# EAGLE design Beacon (EAGLE 9.4.2)
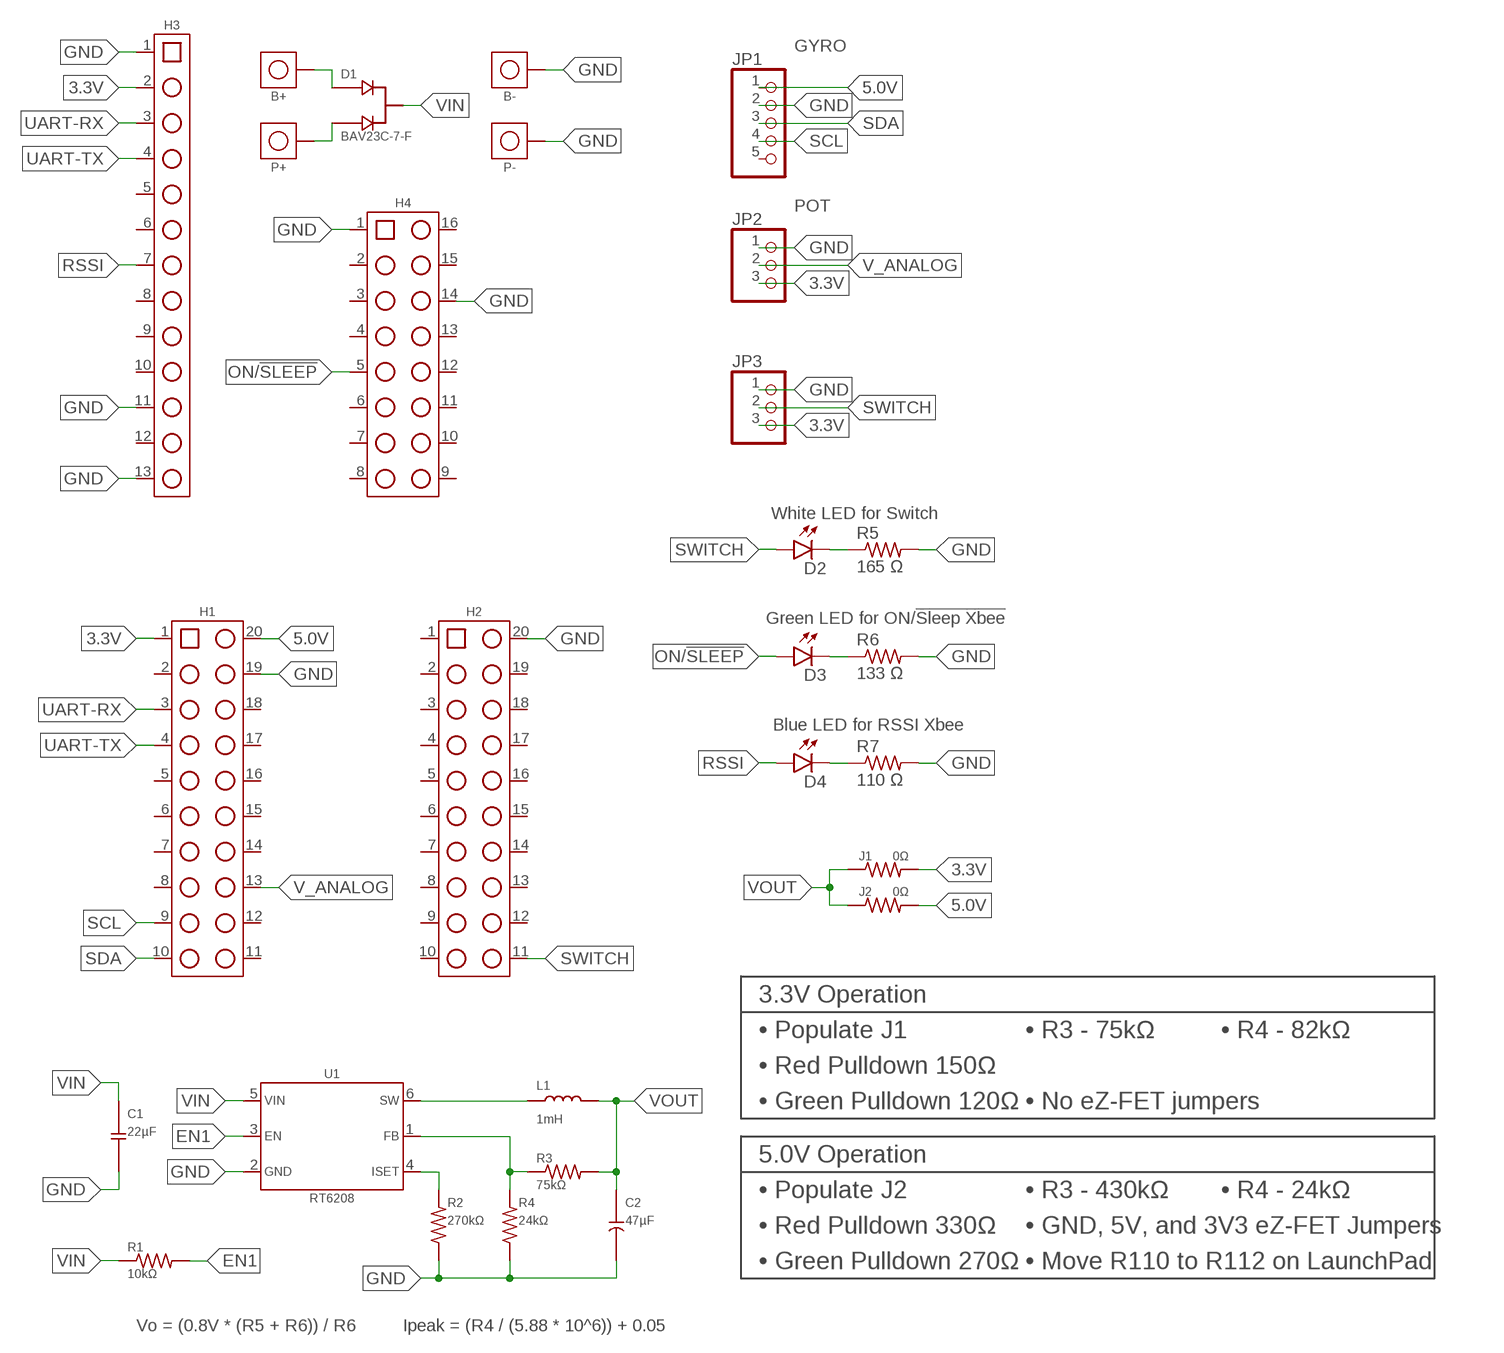
[diagram p0: schematic, sheet 1]

## Parts
B+  CON_HEADER-01WTB-24G  [THT_WTB-24G]
B-  CON_HEADER-01WTB-24G  [THT_WTB-24G]
C1  22µF  PAS_C1206  [SMT_1206]
C2  47µF  PAS_C-POLAR  [SMT_CAP-1206]
D1  BAV23C-7-F  SEM_DIODE-PAIR-CC  [SMT_SOT23-3]
D2  BEAGLEBONE_BLUE_LED-FKIT-1206  [BEAGLEBONE_BLUE_BEAGLEBONE_BLUE_FKIT-LED-1206]
D3  BEAGLEBONE_BLUE_LED-FKIT-1206  [BEAGLEBONE_BLUE_BEAGLEBONE_BLUE_FKIT-LED-1206]
D4  BEAGLEBONE_BLUE_LED-FKIT-1206  [BEAGLEBONE_BLUE_BEAGLEBONE_BLUE_FKIT-LED-1206]
H1  CON_HEADER-20  [CON_HEADER-0.1"-TH-2×10]
H2  CON_HEADER-20  [CON_HEADER-0.1"-TH-2×10]
H3  CON_HEADER-13SM-B  [CON_HEADER-2MM-SM-1×13B]
H4  CON_HEADER-16SM-B  [CON_HEADER-2MM-SM-1×16B]
J1  0Ω  PAS_R0603  [SMT_0603]
J2  0Ω  PAS_R0603  [SMT_0603]
JP1  PINHD-1X5  [1X05]
JP2  PINHD-1X3/90  [1X03/90]
JP3  PINHD-1X3/90  [1X03/90]
L1  1mH  PAS_L1210  [SMT_1210]
P+  CON_HEADER-01WTB-24G  [THT_WTB-24G]
P-  CON_HEADER-01WTB-24G  [THT_WTB-24G]
R1  10kΩ  PAS_R0603  [SMT_0603]
R2  270kΩ  PAS_R0603  [SMT_0603]
R3  75kΩ  PAS_R0603  [SMT_0603]
R4  24kΩ  PAS_R0603  [SMT_0603]
R5  165 Ω  ERJ-8GEY0R00V  [RES_1206]
R6  133 Ω  ERJ-8GEY0R00V  [RES_1206]
R7  110 Ω  ERJ-8GEY0R00V  [RES_1206]
U1  RT6208  [SMT_SOT23-6]

## Nets
3.3V: H1.1(PIN_1) H3.2(PIN_2) J1.2 JP2.3 JP3.3
5.0V: H1.20(PIN_20) J2.2 JP1.1
EN1: R1.2 U1.3(B)
FB: R3.1 R4.2 U1.1(E)
GND: B-.1(PIN_1) C1.1 C2.2 H1.19(PIN_19) H2.20(PIN_20) H3.1(PIN_1) H3.11(PIN_11) H3.13(PIN_13) H4.1(PIN_1) H4.14(PIN_14) JP1.2 JP2.1 JP3.1 P-.1(PIN_1) R2.1 R4.1 R5.2 R6.2 R7.2 U1.2(C)
ISET: R2.2 U1.4(D)
N$1: D2.C R5.1
N$2: D3.C R6.1
N$3: D4.C R7.1
N$55: B+.1(PIN_1) D1.1(A1)
N$56: D1.2(A2) P+.1(PIN_1)
ON/!SLEEP: D3.A H4.5(PIN_5)
RSSI: D4.A H3.7(PIN_7)
SCL: H1.9(PIN_9) JP1.4
SDA: H1.10(PIN_10) JP1.3
SW: L1.1 U1.6(F)
SWITCH: D2.A H2.11(PIN_11) JP3.2
UART-RX: H1.3(PIN_3) H3.3(PIN_3)
UART-TX: H1.4(PIN_4) H3.4(PIN_4)
V_ANALOG: H1.13(PIN_13) JP2.2
VIN: C1.2 D1.3(CC) R1.1 U1.5(A)
VOUT: C2.1 J1.1 J2.1 L1.2 R3.2
Unconnected: H1.2(PIN_2) H1.5(PIN_5) H1.6(PIN_6) H1.7(PIN_7) H1.8(PIN_8) H1.11(PIN_11) H1.12(PIN_12) H1.14(PIN_14) H1.15(PIN_15) H1.16(PIN_16) H1.17(PIN_17) H1.18(PIN_18) H2.1(PIN_1) H2.2(PIN_2) H2.3(PIN_3) H2.4(PIN_4) H2.5(PIN_5) H2.6(PIN_6) H2.7(PIN_7) H2.8(PIN_8) H2.9(PIN_9) H2.10(PIN_10) H2.12(PIN_12) H2.13(PIN_13) H2.14(PIN_14) H2.15(PIN_15) H2.16(PIN_16) H2.17(PIN_17) H2.18(PIN_18) H2.19(PIN_19) H3.5(PIN_5) H3.6(PIN_6) H3.8(PIN_8) H3.9(PIN_9) H3.10(PIN_10) H3.12(PIN_12) H4.2(PIN_2) H4.3(PIN_3) H4.4(PIN_4) H4.6(PIN_6) H4.7(PIN_7) H4.8(PIN_8) H4.9(PIN_9) H4.10(PIN_10) H4.11(PIN_11) H4.12(PIN_12) H4.13(PIN_13) H4.15(PIN_15) H4.16(PIN_16) JP1.5

## Notes on the sheet
- GYRO
- POT
- White LED for Switch
- Green LED for ON/!Sleep Xbee
- Blue LED for RSSI Xbee
- 3.3V Operation
- • Populate J1 | • R3 - 75kΩ | • R4 - 82kΩ
- • Red Pulldown 150Ω
- • Green Pulldown 120Ω | • No eZ-FET jumpers
- 5.0V Operation
- • Populate J2 | • R3 - 430kΩ | • R4 - 24kΩ
- • Red Pulldown 330Ω | • GND, 5V, and 3V3 eZ-FET Jumpers
- • Green Pulldown 270Ω | • Move R110 to R112 on LaunchPad
- Vo = (0.8V * (R5 + R6)) / R6 | Ipeak = (R4 / (5.88 * 10^6)) + 0.05

## Library data of the parts
B+ B- P+ P- = Andrew:CON_HEADER-01
C1 = Andrew:PAS_C
C2 = Andrew:PAS_C-POLAR
D1 = Andrew:SEM_DIODE-PAIR-CC: MMBD1204
D2-D4 = BeagleBone_Blue_R3:BEAGLEBONE_BLUE_LED: LEDs Standard schematic elements and footprints for 5mm, 3mm, 1206, and 0603 sized LEDs. 5mm - Spark Fun Electronics SKU : COM-00529 (and others)
H1 H2 = Andrew:CON_HEADER-20
H3 = Andrew:CON_HEADER-13; P1: 1
H4 = Andrew:CON_HEADER-16; P1: 22
J1 J2 R1-R4 = Andrew:PAS_R
JP1 = pinhead:PINHD-1X5: PIN HEADER
JP2 JP3 = pinhead:PINHD-1X3: PIN HEADER
L1 = Andrew:PAS_L
R5-R7 = Resistor_Capacitor:ERJ-8GEY0R00V: RES SMD 0 OHM JUMPER 1/4W 1206 Manufacturer's datasheet <https://industrial.panasonic.com/ww/products/resistors/chip-resistors/general-purpose-chip-resistors/thick-film-chip-resistors/ERJ8GEY0R00V>; CREATED_BY: PCBLayout.com; DIGIKEY_PART_NUMBER: P0.0ETR-ND; MANUFACTURER: Panasonic Electronic Components; MPN: ERJ-8GEY0R00V; PACKAGE: SMD 1206
U1 = Andrew:RT6208; A: VIN; B: EN; C: GND; D: ISET; E: FB; F: SW; P1: ▼

## Board
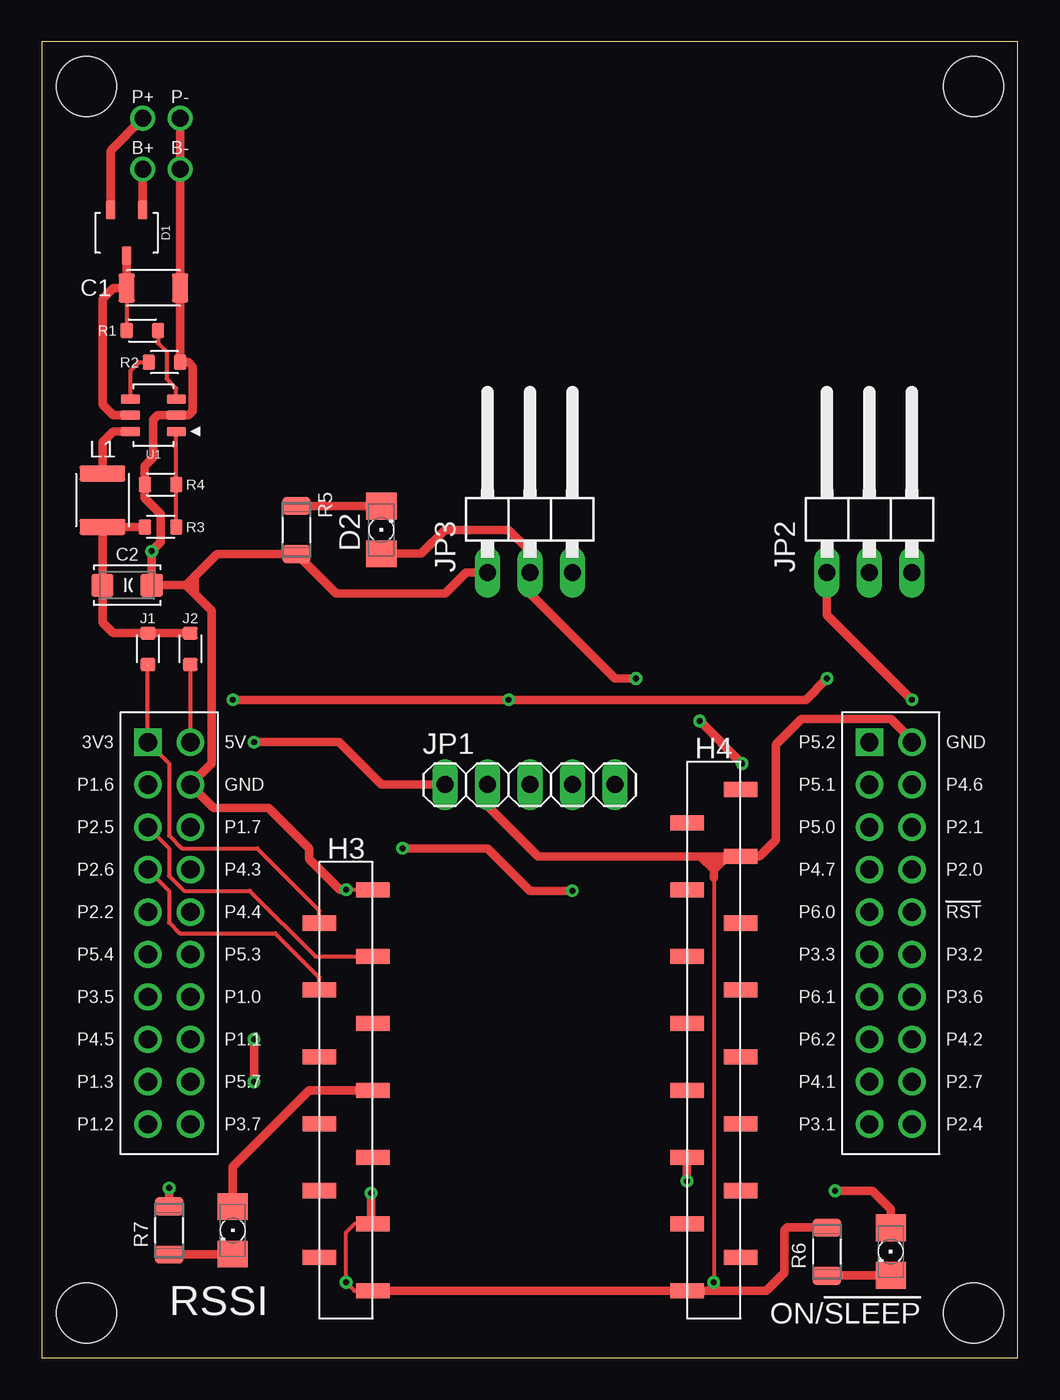
[diagram p1: board, top side]
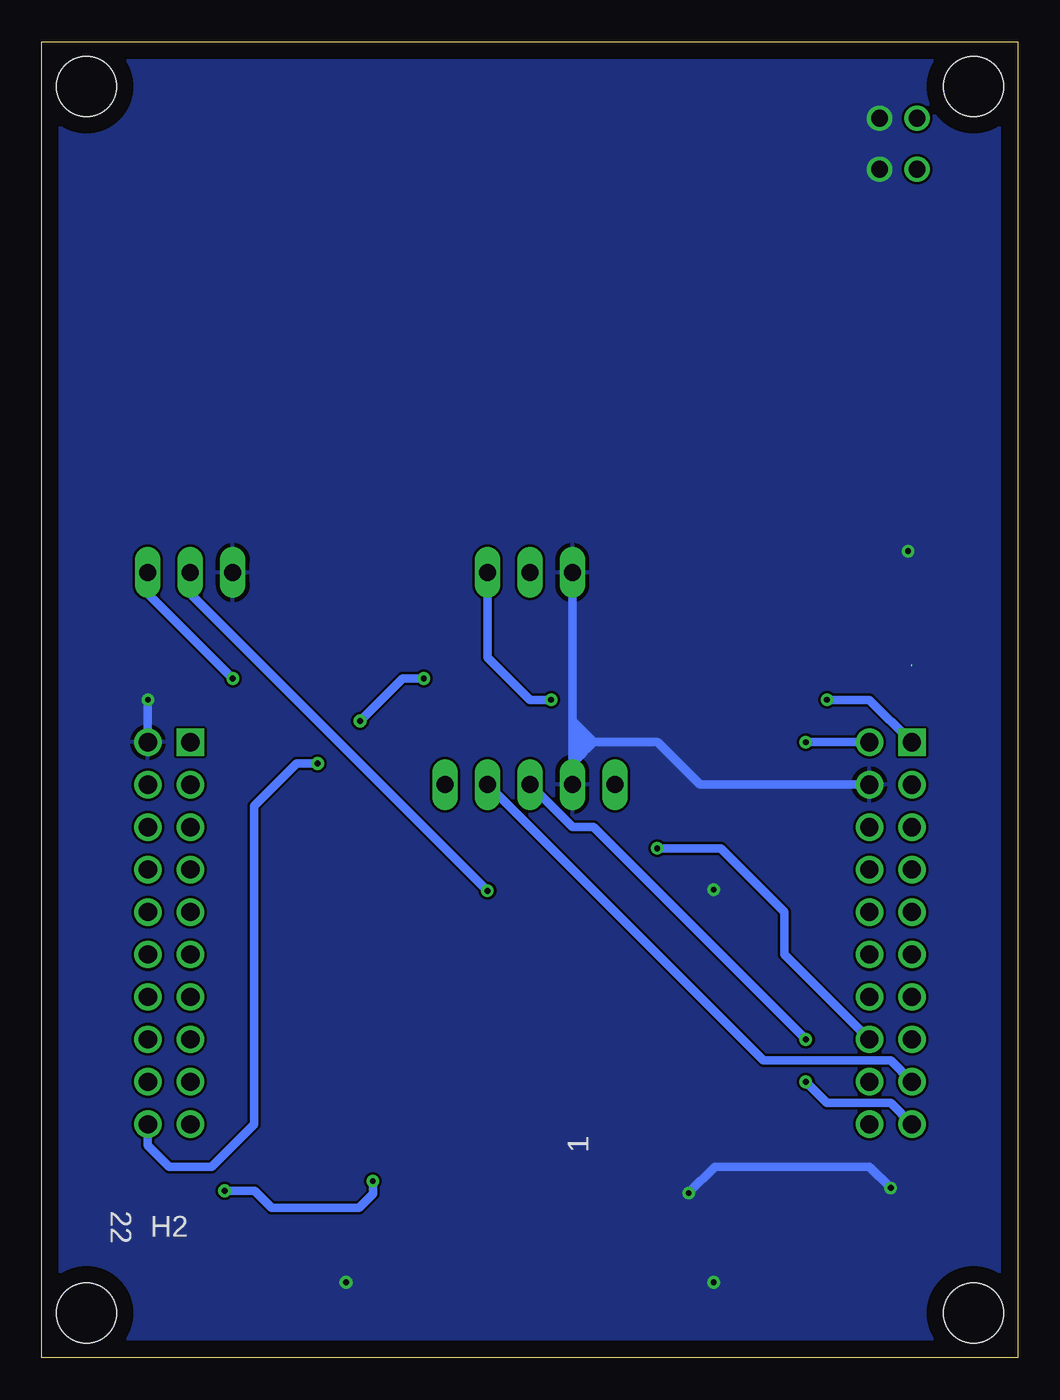
[diagram p2: board, bottom side, seen from below]

Size 58.42 x 78.74 mm. Coordinates in mm from the lower left corner, seen from the top.
Outline: 0,0 58.42,0 58.42,78.74 0,78.74 0,0
Copper layers (1*16): Top 0.035mm / dielectric 1.5mm / Bottom 0.035mm
Design rules "default": minimum track width 6mil, minimum drill 0.35mm, track to track 6mil, track to pad 6mil, pad to pad 6mil, via to via 6mil, smd to smd 6mil, copper to edge 40mil, drill to drill 6mil, minimum pad ring 10mil, minimum via ring 8mil, stop-mask expansion 4mil, vias tented up to drill 0mil, thermal gap 10mil
Holes 3.57 mm at 55.75,76.07 2.67,76.07 2.67,2.67 55.75,2.67

### Footprints (pad centres in the part's own frame; a part is rotated, then mirrored left to right if it is on the bottom)
THT_WTB-24G = drill 1: 1 0,0
SMT_1206 = smd 0.965 x 1.727: 1 -1.6,0; 2 1.6,0
SMT_CAP-1206 = smd 1.321 x 1.372: 1 -1.473,0; 2 1.473,0
SMT_SOT23-3 = smd 0.559 x 1.118: 1 -0.965,-1.372; 2 0.965,-1.372; 3 0,1.372
BEAGLEBONE_BLUE_BEAGLEBONE_BLUE_FKIT-LED-1206 = smd 1.6 x 1.803: A -1.422,0; C 1.422,0
CON_HEADER-0.1"-TH-2×10 = drill 1.092 square: 1 -11.43,-1.27 | drill 1.092: 2 -8.89,-1.27; 3 -6.35,-1.27; 4 -3.81,-1.27; 5 -1.27,-1.27; 6 1.27,-1.27; 7 3.81,-1.27; 8 6.35,-1.27; 9 8.89,-1.27; 10 11.43,-1.27; 11 11.43,1.27; 12 8.89,1.27; 13 6.35,1.27; 14 3.81,1.27; 15 1.27,1.27; 16 -1.27,1.27; 17 -3.81,1.27; 18 -6.35,1.27; 19 -8.89,1.27; 20 -11.43,1.27
CON_HEADER-2MM-SM-1×13B = smd 0.9 x 2: 1 -12,1.6; 2 -10,-1.6; 3 -8,1.6; 4 -6,-1.6; 5 -4,1.6; 6 -2,-1.6; 7 0,1.6; 8 2,-1.6; 9 4,1.6; 10 6,-1.6; 11 8,1.6; 12 10,-1.6; 13 12,1.6
CON_HEADER-2MM-SM-1×16B = smd 0.9 x 2: 1 -15,1.6; 2 -13,-1.6; 3 -11,1.6; 4 -9,-1.6; 5 -7,1.6; 6 -5,-1.6; 7 -3,1.6; 8 -1,-1.6; 9 1,1.6; 10 3,-1.6; 11 5,1.6; 12 7,-1.6; 13 9,1.6; 14 11,-1.6; 15 13,1.6; 16 15,-1.6
SMT_0603 = smd 0.762 x 0.914: 1 -0.94,0; 2 0.94,0
1X05 = drill 1.016 long: 1 -5.08,0; 2 -2.54,0; 3 0,0; 4 2.54,0; 5 5.08,0
1X03/90 = drill 1.016 long: 1 -2.54,-3.81; 2 0,-3.81; 3 2.54,-3.81
SMT_1210 = smd 0.965 x 2.743: 1 -1.6,0; 2 1.6,0
RES_1206 = smd 1.08 x 1.68: 1 -1.445,0; 2 1.445,0
SMT_SOT23-6 = smd 0.559 x 1.118: 1 -0.965,-1.372; 2 0,-1.372; 3 0.965,-1.372; 4 0.965,1.372; 5 0,1.372; 6 -0.965,1.372

### Placement (x,y rotation side)
B+  6.05,71.12 90 top
B-  8.28,71.12 90 top
C1  6.68,64.01 180 top
C2  5.11,46.23 0 top
D1  5.08,67.31 180 top
D2  20.32,49.53 90 top
D3  50.8,6.35 270 top
D4  11.43,7.62 270 top
H1  7.62,25.4 270 top
H2  50.8,25.4 270 top
H3  18.21,16 270 top
H4  40.21,19 90 top
J1  6.35,42.42 270 top
J2  8.89,42.42 270 top
JP1  29.21,34.29 0 top
JP2  49.53,50.8 0 top
JP3  29.21,50.8 0 top
L1  3.63,51.31 270 top
P+  6.05,74.17 90 top
P-  8.28,74.17 90 top
R1  6.02,61.47 0 top
R2  7.34,59.56 180 top
R3  7.11,49.71 180 top
R4  7.11,52.25 0 top
R5  15.24,49.53 270 top
R6  46.99,6.35 90 top
R7  7.62,7.62 90 top
U1  6.68,56.39 90 top

### Tracks (layer width: path | path; a pad name or v marks a point on that pad's centre or on a via)
3.3V  (via drill 0.35)  (1 unrouted)
  Top 0.254: H3.2 16.61,26.76 12.89,30.48 8.38,30.48 7.62,31.24 7.62,35.56 H1.1 6.35,41.4
  Top 0.508: v46.99,40.64 45.72,39.37 v27.94,39.37 v11.43,39.37
  Bottom 0.508: JP2.3 52.07,45.72 v46.99,40.64 | v11.43,39.37 8.89,39.37 H1.1 | v27.94,39.37 29.21,39.37 31.75,41.91 JP3.3
5.0V  (via drill 0.35)
  Top 0.254: J2.2 H1.20
  Top 0.508: v12.7,36.83 17.78,36.83 20.32,34.29 JP1.1
  Bottom 0.508: v12.7,36.83 H1.20
EN1
  Top 0.254: U1.3 8.05,57.99 7.47,58.57 7.47,60.2 6.96,60.71 R1.2
FB
  Top 0.254: R3.1 R4.2 U1.1
GND  (via drill 0.35)
  Top 0.254: H3.1 v18.21,28 | H4.1 39.37,4 39.7,4 v40.21,4.51 | 40.21,28.7 v40.21,4.51 | H3.13 18.72,4 v18.21,4.51 18.21,7.49 18.72,8 19.63,8 H3.11 | 40.64,4 40.64,4.08 v40.21,4.51 | v40.21,4.51 40.21,4
  Top 0.508: P-.1 B-.1 C1.1 R2.1 8.79,59.56 9.04,59.31 9.04,56.64 8.79,56.39 U1.2 6.93,56.39 6.68,56.13 6.68,53.85 6.17,53.34 R4.1 6.17,51.44 7.11,50.49 7.11,48.79 v6.58,48.26 C2.2 8.64,46.23 | 9.14,45.72 10.16,44.7 10.16,35.56 H1.19 10.29,32.89 13.59,32.89 16,30.48 16,29.84 17.84,28 v18.21,28 | 9.14,45.72 8.64,46.23 | H2.20 52.07,36.96 50.8,38.23 45.47,38.23 43.94,36.7 43.94,30.99 42.96,30 H4.14 41,30 | H3.13 H4.1 | JP1.2 26.67,33.02 29.69,30 39.42,30 | 39.42,30 40.13,30 | 40.13,30 41,30 | 40.21,29.21 40.21,29.92 40.13,30 | 40.21,29.21 39.42,30 | 40.21,29.21 41,30 | 40.21,29.21 40.21,28.7 | JP2.1 46.99,44.45 v52.07,39.37 | JP3.1 25.4,46.99 24.13,45.72 17.61,45.72 R5.2 10.49,48.09 9.14,46.74 | 8.64,46.23 9.14,46.74 | 9.14,46.74 9.14,45.72 | R7.2 v7.62,10.16 | v19.71,9.86 19.71,8.08 19.63,8 | R6.2 44.62,7.79 44.45,7.62 44.45,5.08 43.37,4 40.64,4 40.21,4 39.37,4
  Bottom 0.508: 26.67,35.56 JP1.2 26.67,36.83 | 26.04,36.2 26.67,35.56 | 26.04,36.2 25.84,36.39 | 25.4,36.83 21.59,36.83 19.05,34.29 H1.19 | v52.07,39.37 H2.20 | 26.67,36.96 26.67,38.1 | 26.67,38.1 JP3.1 | 26.67,36.83 26.23,36.39 | 26.23,36.39 26.04,36.2 | 26.67,35.56 26.67,35.94 26.23,36.39 | 25.4,36.83 26.67,36.83 | 25.4,36.83 25.84,36.39 | 25.84,36.39 26.23,36.39 | 25.4,36.83 25.91,37.34 | 25.91,37.34 26.1,37.53 | 26.1,37.53 26.67,38.1 | 26.67,36.83 26.67,36.96 | 26.67,36.96 26.1,37.53 | 26.67,36.83 26.16,37.34 25.91,37.34 | v7.62,10.16 8.89,11.43 18.14,11.43 v19.71,9.86
  pour Bottom: 0,78.74 58.42,78.74 58.42,0 0,0
ISET
  Top 0.254: U1.4 5.31,59.05 5.82,59.56 R2.2
N$1
  Top 0.508: D2.C 15.26,50.95 R5.1
N$2
  Top 0.508: D3.C 47.01,4.93 R6.1
N$3
  Top 0.508: D4.C 7.64,6.2 R7.1
N$55
  Top 0.508: B+.1 D1.1
N$56
  Top 0.508: P+.1 4.12,72.24 D1.2
ON/!SLEEP  (via drill 0.35)
  Top 0.508: H4.5 v38.61,10.57 | v47.47,9.98 49.71,9.98 50.8,8.89 D3.A
  Bottom 0.508: v38.61,10.57 38.61,9.8 39.45,8.97 44.68,8.97 45.7,9.98 v47.47,9.98
RSSI
  Top 0.508: H3.7 16,16 11.43,11.43 D4.A
SCL
  Bottom 0.508: H1.9 7.62,17.78 15.24,17.78 JP1.4
SDA  (via drill 0.35)
  Top 0.508: v12.7,16.51 v12.7,19.05
  Bottom 0.508: H1.10 7.62,15.24 11.43,15.24 v12.7,16.51 | v12.7,19.05 25.4,31.75 26.67,31.75 JP1.3
SW
  Top 0.508: U1.6 4.27,55.42 3.63,54.79 L1.1
SWITCH  (via drill 0.35)
  Top 0.508: v35.56,40.64 34.29,40.64 29.21,45.72 JP3.2 29.21,48.26 27.94,49.53 24.13,49.53 22.71,48.11 D2.A | v39.37,38.1 v41.91,35.56
  Bottom 0.508: v35.56,40.64 36.83,40.64 v39.37,38.1 | v41.91,35.56 43.18,35.56 45.72,33.02 45.72,13.97 48.26,11.43 50.8,11.43 52.07,12.7 H2.11
UART-RX
  Top 0.254: H1.3 7.62,30.48 7.62,28.83 8.51,27.94 12.44,27.94 16.38,24 H3.3
UART-TX
  Top 0.254: H1.4 7.62,27.94 7.62,26.04 8.26,25.4 13.97,25.4 16.61,22.76 H3.4
V_ANALOG  (via drill 0.35)
  Top 0.508: v21.59,30.48 26.67,30.48 29.21,27.94 v31.75,27.94
  Bottom 0.508: H1.13 13.97,24.13 13.97,26.67 17.78,30.48 v21.59,30.48 | v31.75,27.94 49.53,45.72 JP2.2
VIN
  Top 0.254: C1.2 R1.1
  Top 0.508: U1.5 4.27,56.39 3.63,57.02 3.63,63.37 4.27,64.01 C1.2 D1.3
VOUT
  Top 0.508: J2.1 J1.1 4.27,43.36 3.63,43.99 C2.1 L1.2 R3.2

### Text on the board
tNames: 3V3 | 5V | P5.2 | GND | P1.6 | GND | P5.1 | P4.6 | P2.5 | P1.7 | P5.0 | P2.1 | P2.6 | P4.3 | P4.7 | P2.0 | P2.2 | P4.4 | P6.0 | RST | P5.4 | P5.3 | P3.3 | P3.2 | P3.5 | P1.0 | P6.1 | P3.6 | P4.5 | P1.1 | P6.2 | P4.2 | P1.3 | P5.7 | P4.1 | P2.7 | P1.2 | P3.7 | P3.1 | P2.4 | RSSI | ON/!SLEEP